# EAGLE schematic NinjaPCB-2x2-MooMoo-power_ver2.0 (EAGLE 6.6.0)
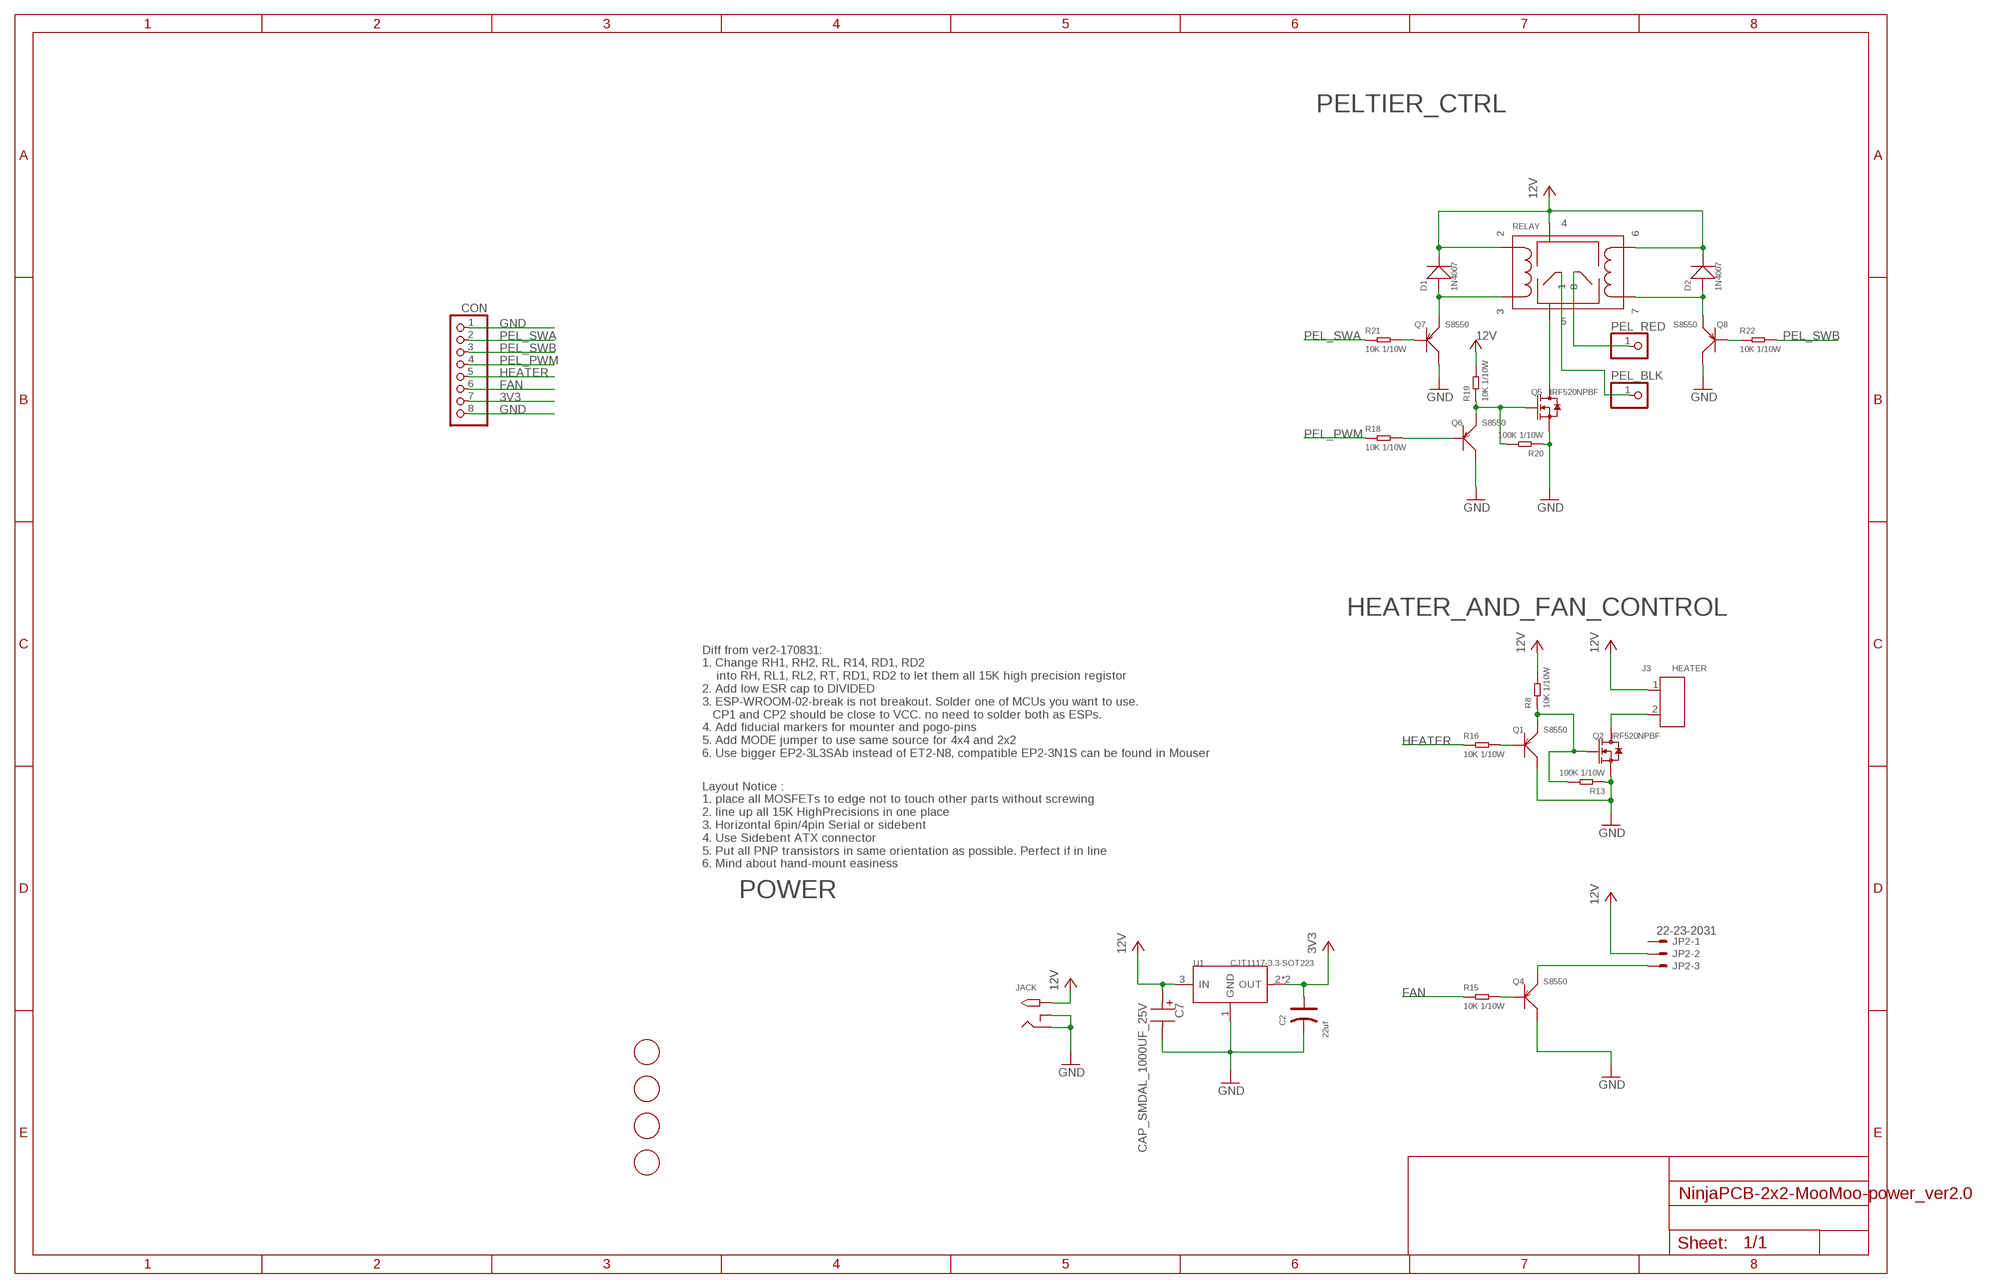
[diagram p0: schematic, sheet 1]

## Parts
C2  22uf  TANTALUM-SMD-22UF-16V(AVX-B)  [AVX-B]
C7  CAP_SMDAL_1000UF_25V  [CAP_SMD_AL_D125]
CON  PINHD-1X8  [1X08]
D1  1N4007  DIODE-GEN-PURPOSE-1KV-1A(DO-214AC)  [DO-214AC]
D2  1N4007  DIODE-GEN-PURPOSE-1KV-1A(DO-214AC)  [DO-214AC]
J3  HEATER  SCREW-TERMINAL-GREEN(2P-3.5)  [H2-3.5-7.0X7.0MM]
JACK  2.1MMJACKTHM  [PJ-102A]
JP2  22-23-2031  [22-23-2031]
PEL_BLK  PINHD-1X1L  [1X01LONG]
PEL_RED  PINHD-1X1L  [1X01LONG]
Q1  S8550  SMD-TRANSISTORS-PNP-25V-500MA-S8550(SOT-23)  [SOT-23]
Q2  IRF520NPBF  DIP-MOSFET-N-CH-100V-9.7A-IRF520NPBF(TO-220AB)CORRECT  [TO-220]
Q4  S8550  SMD-TRANSISTORS-PNP-25V-500MA-S8550(SOT-23)  [SOT-23]
Q5  IRF520NPBF  DIP-MOSFET-N-CH-100V-9.7A-IRF520NPBF(TO-220AB)CORRECT  [TO-220]
Q6  S8550  SMD-TRANSISTORS-PNP-25V-500MA-S8550(SOT-23)  [SOT-23]
Q7  S8550  SMD-TRANSISTORS-PNP-25V-500MA-S8550(SOT-23)  [SOT-23]
Q8  S8550  SMD-TRANSISTORS-PNP-25V-500MA-S8550(SOT-23)  [SOT-23]
R8  10K 1/10W  SMD-RES-10K-5%-1/10W(0603)  [R0603]
R13  100K 1/10W  SMD-RES-100K-5%-1/10W(0603)  [R0603]
R15  10K 1/10W  SMD-RES-10K-5%-1/10W(0603)  [R0603]
R16  10K 1/10W  SMD-RES-10K-5%-1/10W(0603)  [R0603]
R18  10K 1/10W  SMD-RES-10K-5%-1/10W(0603)  [R0603]
R19  10K 1/10W  SMD-RES-10K-5%-1/10W(0603)  [R0603]
R20  100K 1/10W  SMD-RES-100K-5%-1/10W(0603)  [R0603]
R21  10K 1/10W  SMD-RES-10K-5%-1/10W(0603)  [R0603]
R22  10K 1/10W  SMD-RES-10K-5%-1/10W(0603)  [R0603]
RELAY  NEC-RELAY2EP2  [NEC-EP2]
U1  CJT1117-3.3-SOT223  PMIC-CJT1117-3.3(SOT223)  [SOT-223]
U$3  FIDUCIAL  [FIDUCIAL_1MM]
U$4  FIDUCIAL  [FIDUCIAL_1MM]
U$5  FIDUCIAL  [FIDUCIAL_1MM]
U$6  FIDUCIAL  [FIDUCIAL_1MM]

## Nets
3V3: C2.+ U1.2(OUT) U1.TER(OUT)
12V: C7.P$P D1.2(-) D2.2(-) J3.1 JACK.TIP JP2.2 R8.2 R19.2 RELAY.P$2 RELAY.P$4 RELAY.P$6 U1.3(IN)
FAN: R15.1
GND: C2.- C7.P$M CON.1 JACK.RING JACK.RING_SW Q1.3(C) Q2.3(S) Q4.3(C) Q5.3(S) Q6.3(C) Q7.3(C) Q8.3(C) R13.1 R20.1 U1.1(GND)
HEATER: R16.1
N$1: JP2.3 Q4.2(E)
N$2: J3.2 Q2.2(D) Q2.HEAT(D)
N$3: Q5.2(D) Q5.HEAT(D) RELAY.P$5
N$5: Q5.1(G) Q6.2(E) R19.1 R20.2
N$6: PEL_RED.1 RELAY.P$8
N$7: PEL_BLK.1 RELAY.P$1
N$29: Q1.2(E) Q2.1(G) R8.1 R13.2
N$30: Q6.1(B) R18.2
N$31: Q4.1(B) R15.2
N$32: Q1.1(B) R16.2
N$33: D1.1(+) Q7.2(E) RELAY.P$3
N$34: Q7.1(B) R21.2
N$35: Q8.1(B) R22.1
N$36: D2.1(+) Q8.2(E) RELAY.P$7
PEL_PWM: R18.1
PEL_SWA: R21.1
PEL_SWB: R22.2
Unconnected: CON.2 CON.3 CON.4 CON.5 CON.6 CON.7 CON.8 JP2.1

## Notes on the sheet
- PELTIER_CTRL
- HEATER_AND_FAN_CONTROL
- Diff from ver2-170831: 
  1. Change RH1, RH2, RL, R14, RD1, RD2 
      into RH, RL1, RL2, RT, RD1, RD2 to let them all 15K high precision registor
  2. Add low ESR cap to DIVIDED
  3. ESP-WROOM-02-break is not breakout. Solder one of MCUs you want to use.
     CP1 and CP2 should be close to VCC. no need to solder both as ESPs.
  4. Add fiducial markers for mounter and pogo-pins
  5. Add MODE jumper to use same source for 4x4 and 2x2
  6. Use bigger EP2-3L3SAb instead of ET2-N8, compatible EP2-3N1S can be found in Mouser
- Layout Notice :
  1. place all MOSFETs to edge not to touch other parts without screwing
  2. line up all 15K HighPrecisions in one place
  3. Horizontal 6pin/4pin Serial or sidebent
  4. Use Sidebent ATX connector
  5. Put all PNP transistors in same orientation as possible. Perfect if in line
  6. Mind about hand-mount easiness
- POWER

## Library data of the parts
C2 = Seeed-Capacitor:TANTALUM-SMD-22UF-16V(AVX-B): 302020013; MPN: TAJB226*016#NJ
C7 = Seeed-OPL-2017-01-Capacitor-akita:CAP_SMDAL_1000UF_25V: SMD CAP Aluminum 1000uF-25V;D12.5*H13.5mm SKU: 302030098
CON = pinhead:PINHD-1X8: PIN HEADER
D1 D2 = Seeed-Diode:DIODE-GEN-PURPOSE-1KV-1A(DO-214AC): 304010013; MPN: 1N4007
J3 = Seeed-Connector:SCREW-TERMINAL-GREEN(2P-3.5): 320110028; VALUE: GREEN-2P-3.5
JACK = adafruit:2.1MMJACK: 2.1mm x 5.5mm THM DC jack with internal switch. Digikey part #PJ-102A, 4UCON part #05537 2.1mm x 5.5mm SMT DC jack with internal switch. Digikey part #PJ-002A-SMT, 4UCON part #03267 By microbuilder.eu & adafruit.com
JP2 = con-molex:22-23-2031: .100" (2.54mm) Center Header - 3 Pin; MF: MOLEX; MPN: 22-23-2031; OC_FARNELL: 1462950; OC_NEWARK: 30C0862
PEL_BLK PEL_RED = pinhead:PINHD-1X1: PIN HEADER
Q1 Q4 Q6-Q8 = Seeed-Transistor:SMD-TRANSISTORS-PNP-25V-500MA-S8550(SOT-23): 305020006; MPN: S8550
Q2 Q5 = Seeed-Transistor:DIP-MOSFET-N-CH-100V-9.7A-IRF520NPBF(TO-220AB): 305030059
R8 R15 R16 R18 R19 R21 R22 = Seeed-Resistor:SMD-RES-10K-5%-1/10W(0603): 301010293; MPN: RC0603JR-0710KL
R13 R20 = Seeed-Resistor:SMD-RES-100K-5%-1/10W(0603): 301010089; MPN: RC0603JR-07100KL
RELAY = PCR-Switch:NEC-RELAY2
U1 = Seeed-IC:PMIC-CJT1117-3.3(SOT223): 310030097; MPN: CJT1117-3.3
U$3-U$6 = adafruit:FIDUCIAL: For use by pick and place machines to calibrate the vision/machine, 1mm By microbuilder.eu

## Net classes
1 2A: width 0.406 mm
2 8A: width 2.54 mm